# EAGLE design main (EAGLE 9.6.1)
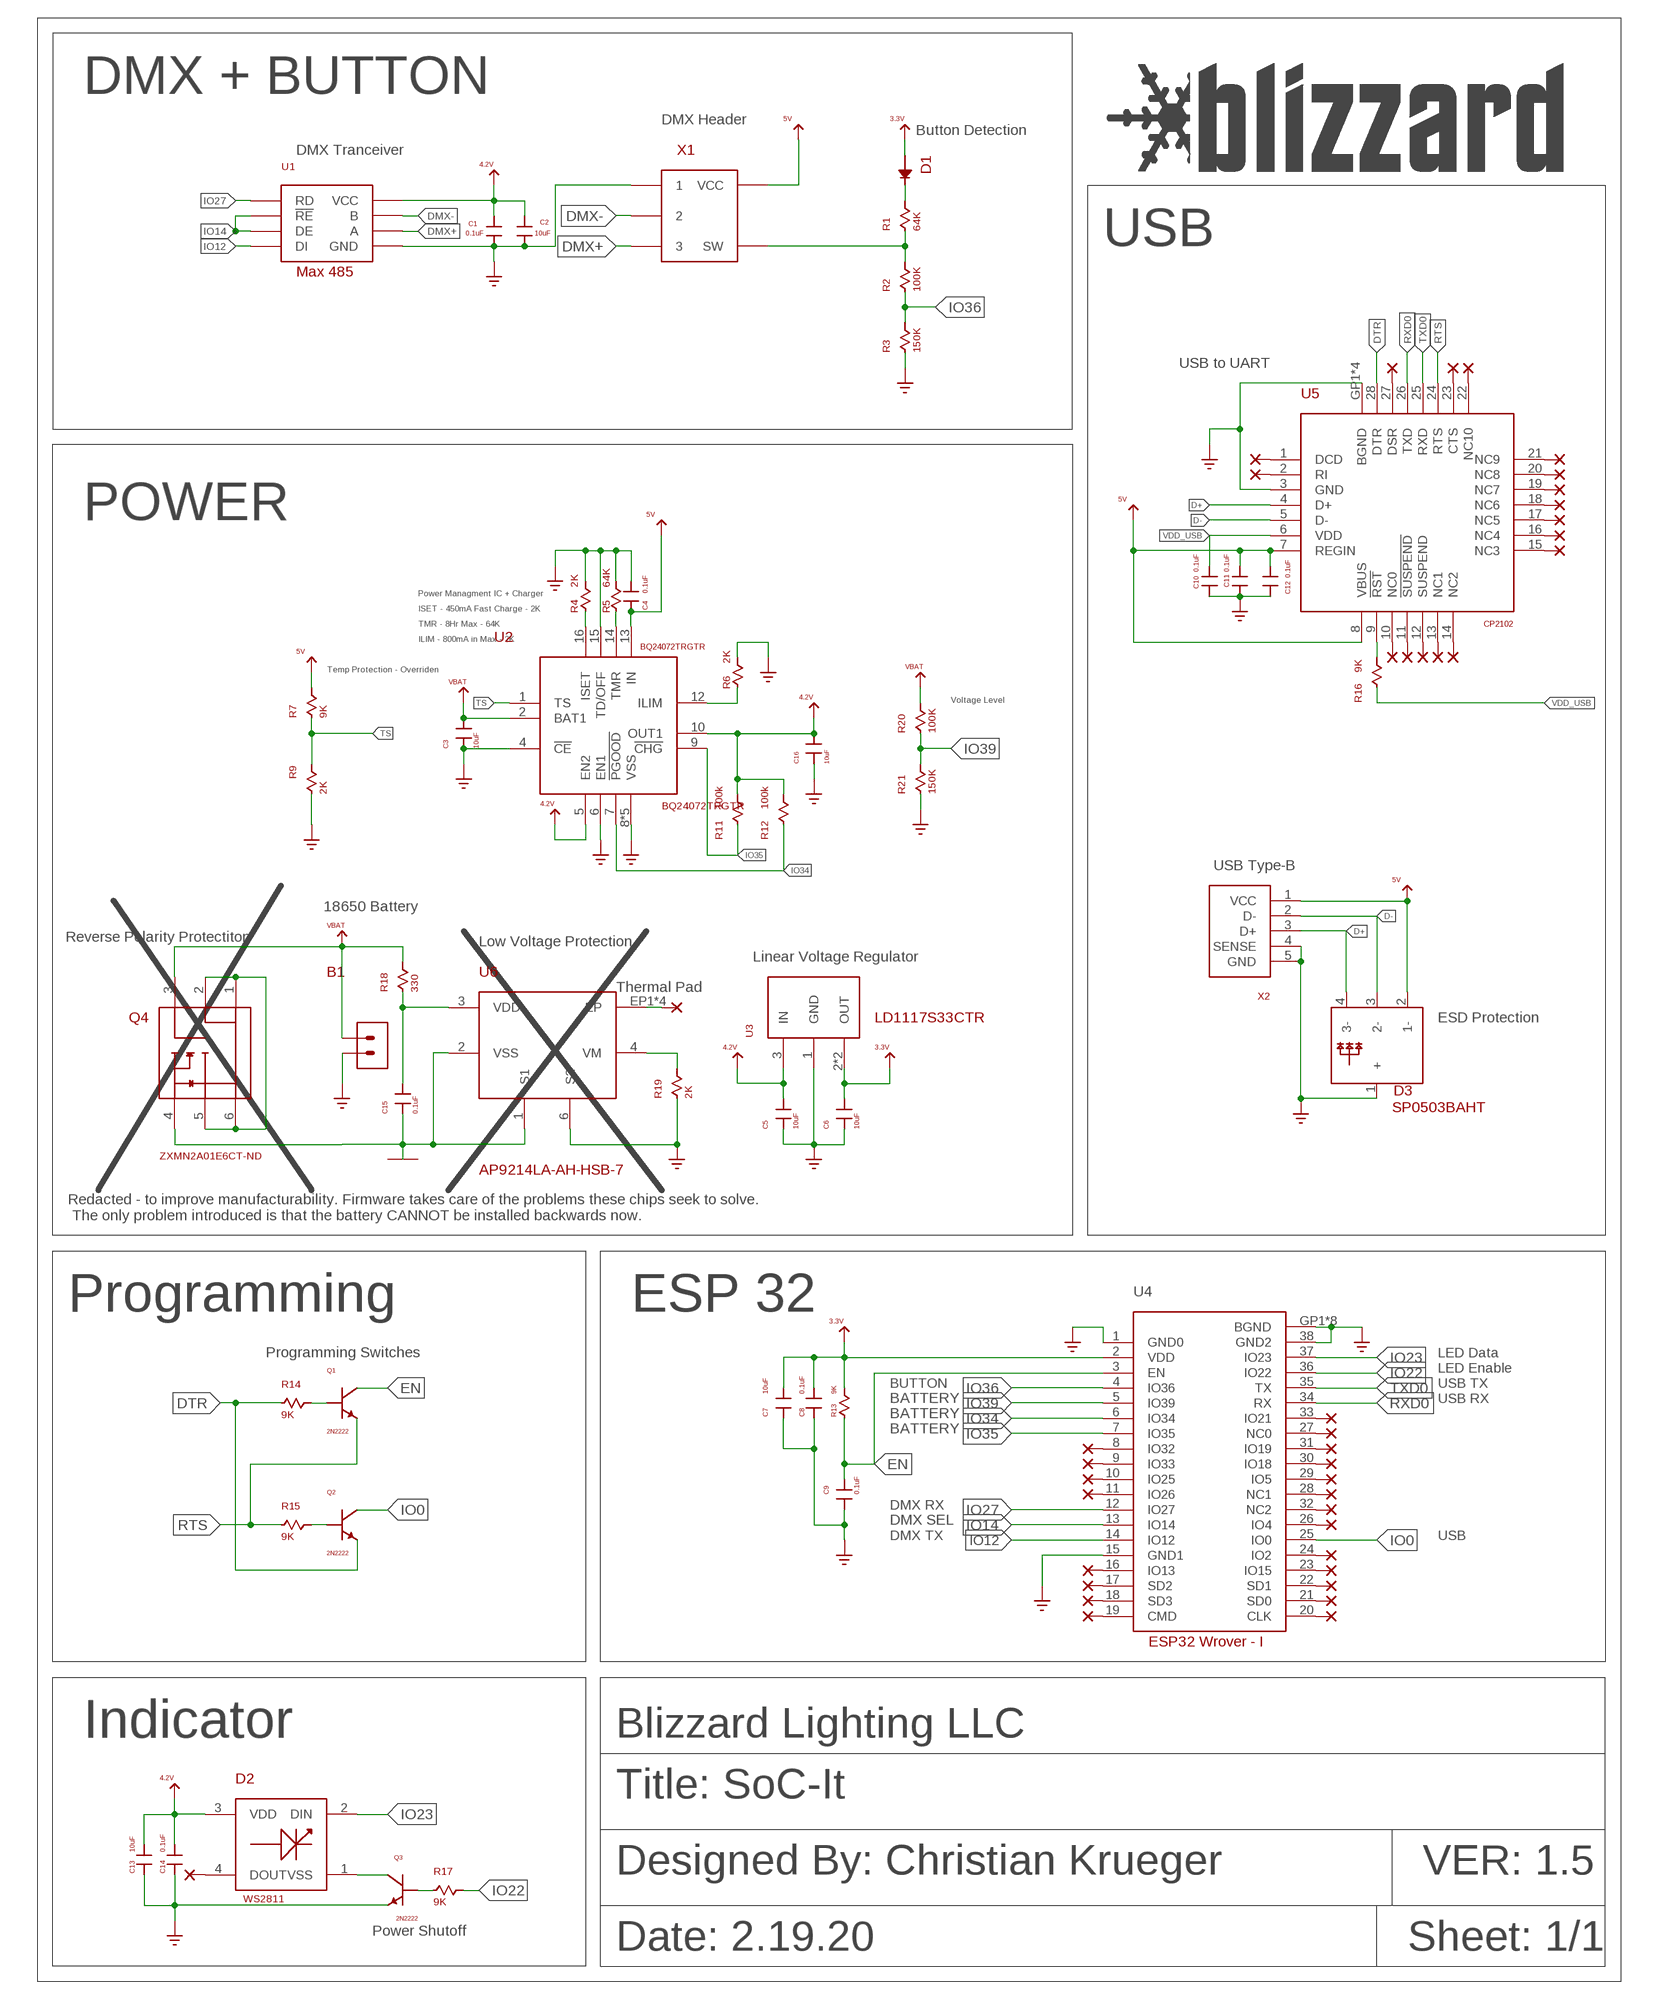
[diagram p0: schematic, sheet 1]

## Parts
B1  18650_BATTERY_DEV  [18650_BATTERY_PKG]
C1  0.1uF  0603_CAP_DEV3D  [CAPC1508X55]
C2  10uF  0603_CAP_DEV3D  [CAPC1508X55]
C3  10uF  0603_CAP_DEV3D  [CAPC1508X55]
C4  0.1uF  0603_CAP_DEV3D  [CAPC1508X55]
C5  10uF  0603_CAP_DEV3D  [CAPC1508X55]
C6  10uF  0603_CAP_DEV3D  [CAPC1508X55]
C7  10uF  0603_CAP_DEV3D  [CAPC1508X55]
C8  0.1uF  0603_CAP_DEV3D  [CAPC1508X55]
C9  0.1uF  0603_CAP_DEV3D  [CAPC1508X55]
C10  0.1uF  0603_CAP_DEV3D  [CAPC1508X55]
C11  0.1uF  0603_CAP_DEV3D  [CAPC1508X55]
C12  0.1uF  0603_CAP_DEV3D  [CAPC1508X55]
C13  10uF  0603_CAP_DEV3D  [CAPC1508X55]
C14  0.1uF  0603_CAP_DEV3D  [CAPC1508X55]
C15  0.1uF  0603_CAP_DEV3D  [CAPC1508X55]
C16  10uF  0603_CAP_DEV3D  [CAPC1508X55]
D1  0603_DIODE_DEV  [0603_DIODE]
D2  5050_DEV  [5050_PKG]
D3  USB_ESD_DEVSOT143  [SOT192P237X122-4]
GND1  GND  (no package)
GND2  GND  (no package)
GND3  GND  (no package)
GND4  GND  (no package)
GND5  GND  (no package)
GND6  GND  (no package)
GND7  GND  (no package)
GND8  GND  (no package)
GND9  GND  (no package)
GND10  GND  (no package)
GND11  GND  (no package)
GND12  GND  (no package)
GND13  GND  (no package)
GND14  GND  (no package)
GND15  GND  (no package)
GND16  GND  (no package)
GND17  GND  (no package)
GND18  GND  (no package)
GND19  GND  (no package)
GND20  GND  (no package)
GND21  GND  (no package)
NC1  NC  (no package)
NC2  NC  (no package)
NC3  NC  (no package)
NC4  NC  (no package)
NC5  NC  (no package)
NC6  NC  (no package)
NC7  NC  (no package)
NC8  NC  (no package)
NC9  NC  (no package)
NC10  NC  (no package)
NC11  NC  (no package)
NC12  NC  (no package)
NC13  NC  (no package)
NC14  NC  (no package)
NC15  NC  (no package)
NC16  NC  (no package)
NC17  NC  (no package)
NC18  NC  (no package)
NC19  NC  (no package)
NC20  NC  (no package)
NC21  NC  (no package)
NC22  NC  (no package)
NC23  NC  (no package)
NC24  NC  (no package)
NC25  NC  (no package)
NC26  NC  (no package)
NC27  NC  (no package)
NC28  NC  (no package)
NC29  NC  (no package)
NC30  NC  (no package)
NC31  NC  (no package)
NC32  NC  (no package)
NC33  NC  (no package)
NC34  NC  (no package)
NC35  NC  (no package)
NC36  NC  (no package)
NC37  NC  (no package)
NC38  NC  (no package)
NC39  NC  (no package)
NC40  NC  (no package)
Q1  2N2222  SOT23_TRANS3D  [SOT95P242X120-3]
Q2  2N2222  SOT23_TRANS3D  [SOT95P242X120-3]
Q3  2N2222  SOT23_TRANS3D  [SOT95P242X120-3]
Q4  N_MOSFET_DEVSOT23-6L_PKG  [SOT95P280X125-6]
R1  64K  0603_RES_DEV3D  [RESC1608X55]
R2  100K  0603_RES_DEV3D  [RESC1608X55]
R3  150K  0603_RES_DEV3D  [RESC1608X55]
R4  2K  0603_RES_DEV3D  [RESC1608X55]
R5  64K  0603_RES_DEV3D  [RESC1608X55]
R6  2K  0603_RES_DEV3D  [RESC1608X55]
R7  9K  0603_RES_DEV3D  [RESC1608X55]
R9  2K  0603_RES_DEV3D  [RESC1608X55]
R11  100k  0603_RES_DEV3D  [RESC1608X55]
R12  100k  0603_RES_DEV3D  [RESC1608X55]
R13  9K  0603_RES_DEV3D  [RESC1608X55]
R14  9K  0603_RES_DEV3D  [RESC1608X55]
R15  9K  0603_RES_DEV3D  [RESC1608X55]
R16  9K  0603_RES_DEV3D  [RESC1608X55]
R17  9K  0603_RES_DEV3D  [RESC1608X55]
R18  330  0603_RES_DEV3D  [RESC1608X55]
R19  2K  0603_RES_DEV3D  [RESC1608X55]
R20  100K  0603_RES_DEV3D  [RESC1608X55]
R21  150K  0603_RES_DEV3D  [RESC1608X55]
U1  MAX_485_DEV3D  [SOIC127P600X175-8]
U2  BQ24072TRGTR_DEVBQ24072TRGTR  [QFN50P300X300X100-17T168]
U3  LD1117S33CTR_DEVLD1117S33CTR  [SOT230P700X180-4]
U4  ESP_32_WROVER_I_PKG  [ESP32_WROVER_I_PKG]
U5  USB_TO_UART_DEV  [QFN50P500X500X100-28]
U6  AP9214L_DEV  [U-DFN2535-6_PKG]
VCC1  5V  VCC  (no package)
VCC2  3.3V  VCC  (no package)
VCC3  4.2V  VCC  (no package)
VCC4  5V  VCC  (no package)
VCC5  5V  VCC  (no package)
VCC6  VBAT  VCC  (no package)
VCC7  4.2V  VCC  (no package)
VCC8  4.2V  VCC  (no package)
VCC9  4.2V  VCC  (no package)
VCC10  3.3V  VCC  (no package)
VCC11  3.3V  VCC  (no package)
VCC12  5V  VCC  (no package)
VCC13  4.2V  VCC  (no package)
VCC14  5V  VCC  (no package)
VCC15  VBAT  VCC  (no package)
VCC16  VBAT  VCC  (no package)
X1  XLR_FEMALE_PLUG_DEV  [XLR_FEMALE_PLUG_PKG]
X2  USB_ALI_DEV  [CHEAP_USB]

## Nets
3.3V: C6.2 C7.2 C8.2 D1.A+ R13.2 U3.2(OUT) U3.4(OUT) U4.2(VDD) VCC2.P$1 VCC10.P$1 VCC11.P$1
4.2V: C1.1 C2.1 C5.2 C13.2 C14.2 C16.2 D2.3(VDD) R11.2 R12.2 U1.8(VCC) U2.5(EN2) U2.10(OUT1) U3.3(IN) VCC3.P$1 VCC7.P$1 VCC8.P$1 VCC9.P$1 VCC13.P$1
5V: C4.1 C11.2 C12.2 D3.2(1-) R7.2 U2.13(IN) U5.7(REGIN) U5.8(VBUS) VCC1.P$1 VCC4.P$1 VCC5.P$1 VCC12.P$1 VCC14.P$1 X1.VCC X2.1(VCC)
BATTERY_GROUND: Q4.1(D1) Q4.2(D2) Q4.5(D3) Q4.6(D4)
D+: D3.4(3-) U5.4(D+) X2.3(D+)
D-: D3.3(2-) U5.5(D-) X2.2(D-)
DMX+: U1.6(A) X1.3
DMX-: U1.7(B) X1.2
DTR: Q2.2(E) R14.1 U5.28(DTR)
EN: C9.2 Q1.3(C) R13.1 U4.3(EN)
GND: B1.- C1.2 C2.2 C3.1 C4.2 C5.1 C6.1 C7.1 C8.1 C9.1 C10.1 C11.1 C12.1 C13.1 C14.1 C16.1 D3.1(+) GND1.P$1 GND2.P$1 GND3.P$1 GND4.P$1 GND5.P$1 GND6.P$1 GND7.P$1 GND8.P$1 GND9.P$1 GND10.P$1 GND11.P$1 GND12.P$1 GND13.P$1 GND14.P$1 GND15.P$1 GND16.P$1 GND17.P$1 GND18.P$1 GND19.P$1 GND20.P$1 GND21.P$1 Q3.2(E) R3.1 R4.2 R5.2 R6.2 R9.1 R19.1 R21.1 U1.5(GND) U2.4(!CE) U2.6(EN1) U2.8(VSS) U2.15(TD/OFF) U2.GP1(VSS) U2.GP2(VSS) U2.GP3(VSS) U2.GP4(VSS) U3.1(GND) U4.1(GND0) U4.15(GND1) U4.38(GND2) U4.GP1(BGND) U4.GP2(BGND) U4.GP3(BGND) U4.GP4(BGND) U4.GP5(BGND) U4.GP6(BGND) U4.GP8(BGND) U4.GP9(BGND) U5.3(GND) U5.GP1(BGND) U5.GP2(BGND) U5.GP3(BGND) U5.GP4(BGND) U6.6(S2) X1.1 X2.4(SENSE) X2.5(GND)
IO0: Q2.3(C) U4.25(IO0)
IO12: U1.4(DI) U4.14(IO12)
IO14: U1.2(!RE) U1.3(DE) U4.13(IO14)
IO22: R17.2 U4.36(IO22)
IO23: D2.2(DIN) U4.37(IO23)
IO27: U1.1(RD) U4.12(IO27)
IO34: R12.1 U2.7(!PGOOD) U4.6(IO34)
IO35: R11.1 U2.9(!CHG) U4.7(IO35)
IO36: R2.1 R3.2 U4.4(IO36)
IO39: R20.1 R21.2 U4.5(IO39)
N$1: NC7.P$1 U4.17(SD2)
N$2: NC17.P$1 U5.11(!SUSPEND)
N$3: NC9.P$1 U4.18(SD3)
N$4: D2.1(VSS) Q3.3(C)
N$5: Q1.1(B) R14.2
N$6: Q2.1(B) R15.2
N$7: NC15.P$1 U5.1(DCD)
N$8: Q3.1(B) R17.1
N$9: R16.2 U5.9(!RST)
N$10: NC16.P$1 U5.2(RI)
N$11: NC21.P$1 U4.8(IO32)
N$12: NC13.P$1 U5.27(DSR)
N$13: NC14.P$1 U5.23(CTS)
N$14: NC18.P$1 U5.12(SUSPEND)
N$15: NC22.P$1 U4.9(IO33)
N$16: NC23.P$1 U4.10(IO25)
N$17: NC24.P$1 U4.11(IO26)
N$18: NC25.P$1 U4.16(IO13)
N$19: D1.C- R1.2
N$20: R1.1 R2.2 X1.SW
N$21: NC11.P$1 U4.19(CMD)
N$22: NC12.P$1 U4.20(CLK)
N$23: NC10.P$1 U4.21(SD0)
N$24: NC8.P$1 U4.22(SD1)
N$25: NC6.P$1 U4.23(IO15)
N$26: NC5.P$1 U4.24(IO2)
N$27: NC4.P$1 U4.32(NC2)
N$28: NC3.P$1 U4.28(NC1)
N$29: NC2.P$1 U4.29(IO5)
N$30: NC1.P$1 U4.27(NC0)
N$31: D2.4(DOUT) NC19.P$1
N$32: R19.2 U6.4(VM)
N$33: C15.2 R18.1 U6.3(VDD)
N$34: R6.1 U2.12(ILIM)
N$35: R5.1 U2.14(TMR)
N$36: NC26.P$1 U4.26(IO4)
N$37: R4.1 U2.16(ISET)
N$38: NC27.P$1 U4.30(IO18)
N$39: NC28.P$1 U4.31(IO19)
N$40: NC29.P$1 U4.33(IO21)
N$41: NC30.P$1 U5.10(NC0)
N$42: NC31.P$1 U5.14(NC2)
N$43: NC32.P$1 U5.13(NC1)
N$44: NC33.P$1 U5.15(NC3)
N$45: NC34.P$1 U5.16(NC4)
N$46: NC35.P$1 U5.17(NC5)
N$47: NC36.P$1 U5.18(NC6)
N$48: NC37.P$1 U5.19(NC7)
N$49: NC38.P$1 U5.20(NC8)
N$50: NC39.P$1 U5.21(NC9)
N$51: NC40.P$1 U5.22(NC10)
PROTECTION_GROUND: C15.1 Q4.4(S) U6.1(S1) U6.2(VSS)
PROTECTION_THERMAL_PAD: NC20.P$1 U6.EP1(EP) U6.EP2(EP) U6.EP3(EP) U6.EP4(EP)
RTS: Q1.2(E) R15.1 U5.24(RTS)
RXD0: U4.34(RX) U5.26(TXD)
TS: R7.1 R9.2 U2.1(TS)
TXD0: U4.35(TX) U5.25(RXD)
VBAT: B1.+ C3.2 Q4.3(G) R18.2 R20.2 U2.2(BAT1) VCC6.P$1 VCC15.P$1 VCC16.P$1
VDD_USB: C10.2 R16.1 U5.6(VDD)

## Notes on the sheet
- DMX + BUTTON
- DMX Header | Button Detection
- DMX Tranceiver
- USB
- Max 485
- USB to UART
- POWER
- Power Managment IC + Charger
- ISET - 450mA Fast Charge - 2K
- TMR - 8Hr Max - 64K | CP2102
- ILIM - 800mA in Max - 2K
- BQ24072TRGTR
- Temp Protection - Overriden
- Voltage Level
- USB Type-B
- 18650 Battery
- Reverse Polarity Protectiton
- Low Voltage Protection
- Linear Voltage Regulator
- Thermal Pad
- Q4 | LD1117S33CTR | ESD Protection
- AP9214LA-AH-HSB-7
- Redacted - to improve manufacturability. Firmware takes care of the problems these chips seek to solve.
   The only problem introduced is that the battery CANNOT be installed backwards now.
- Programming | ESP 32
- Programming Switches | LED Data
- LED Enable
- BUTTON | USB TX
- BATTERY | USB RX
- BATTERY
- BATTERY
- DMX RX
- DMX SEL
- DMX TX | USB
- ESP32 Wrover - I
- Indicator | Blizzard Lighting LLC
- Title: SoC-It
- Designed By: Christian Krueger | VER: 1.5
- WS2811
- Power Shutoff
- Date: 2.19.20 | Sheet: 1/1

## Library data of the parts
B1 = Blizzard_Library:18650_BATTERY_DEV: 36-1043-ND; PN: 36-1043-ND
C1-C16 = Blizzard_Library:0603_CAP_DEV: 0603 Capacitor
D1 = Blizzard_Library:0603_DIODE_DEV: 0603 Diode
D2 = Blizzard_Library:5050_DEV: 5050 RGB LED; PN: 1528-1104-ND
D3 = Blizzard_Library:USB_ESD_DEV: SP0503BAHT USB ESD Protection; PN: SP0503BAHT
GND1-GND21 = Blizzard_Library:GND: GROUND
NC1-NC40 = Blizzard_Library:NC: NC
Q1-Q3 = Blizzard_Library:SOT23_TRANS: 2N222 PNP Transitor; PN: MMBT2222A-FDICT-ND
Q4 = Blizzard_Library:N_MOSFET_DEV: N Mosfet SOT23-6L; PN: ZXMN2A01E6CT-ND
R1-R7 R9 R11-R21 = Blizzard_Library:0603_RES_DEV: 0603 Resister
U1 = Blizzard_Library:MAX_485_DEV: MAX 485 PN: MAX485CSA+-ND; PN: MAX485EESA+TCT-ND
U2 = Blizzard_Library:BQ24072TRGTR_DEV: IC LI-ION CHARGE MGMT 16QFN 296-27328-1-ND; PN: BQ24072TRGTR
U3 = Blizzard_Library:LD1117S33CTR_DEV: LD1117S33CTR
U4 = Blizzard_Library:ESP_32_WROVER_I_PKG: ESP32-WROVER-I; PN: GC-ESP-WROVER-32
U5 = Blizzard_Library:USB_TO_UART_DEV: SINGLE-CHIP USB-TO-UART BRIDGE PN: 336-1160-5-ND; PN: CP2102
U6 = Blizzard_Library:AP9214L_DEV: SINGLE CHIP SOLUTION FOR 1-CELL Li+ BATTERY PACK Option 1; PN: AP9214L; VERSION: A
VCC1-VCC16 = Blizzard_Library:VCC: VCC
X1 = Blizzard_Library:XLR_FEMALE_PLUG_DEV: XLR Female Plug to PCB
X2 = Blizzard_Library:USB_ALI_DEV: ALI USB Micro B

## Board
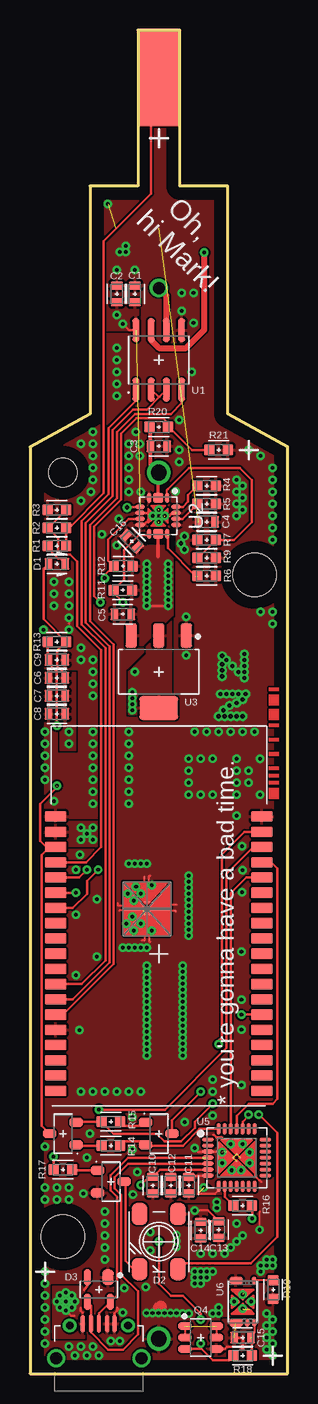
[diagram p1: board, top side]
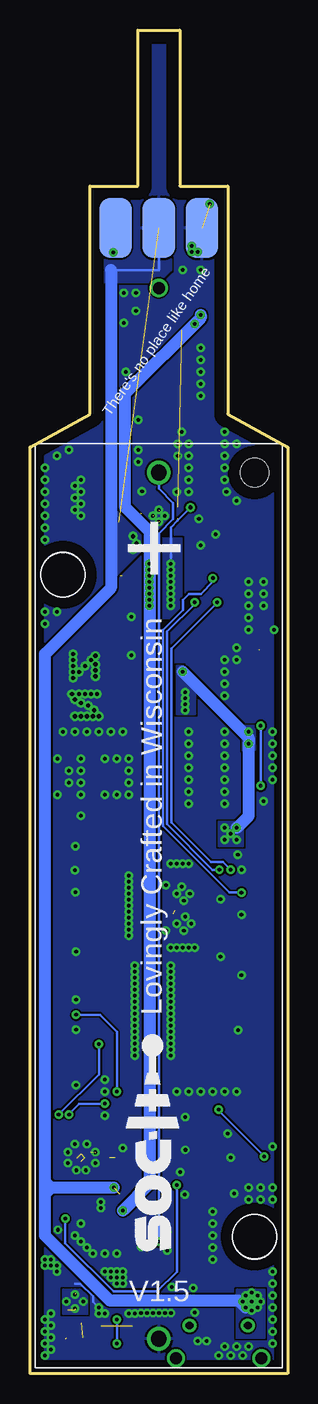
[diagram p2: board, bottom side, seen from below]

Size 21.5 x 112 mm. Coordinates in mm from the lower left corner, seen from the top.
Outline: 16.5,80 16.5,99 12.5,99 12.5,112 9,112 9,99 5,99 5,80 0,77.25 0,0 21.5,0 21.5,77.25 16.5,80
Copper layers (1*16): Top 0.035mm / dielectric 1.5mm / Bottom 0.035mm
Design rules "default *": minimum track width 6mil, minimum drill 0.3mm, track to track 6mil, track to pad 6mil, pad to pad 6mil, via to via 6mil, smd to smd 6mil, copper to edge 40mil, drill to drill 6mil, minimum pad ring 10mil, minimum via ring 8mil, stop-mask expansion 4mil, vias tented up to drill 0.30988125mm, thermal gap 8mil

### Footprints (pad centres in the part's own frame; a part is rotated, then mirrored left to right if it is on the bottom)
18650_BATTERY_PKG = drill 1.32: + 36.11,0; - -36.11,0 | hole 3.6: -27.6,-8; 27.6,8 | hole 2.39: 36.11,-8
CAPC1508X55 = smd 0.657 x 0.979: 1 -0.696,0; 2 0.696,0
0603_DIODE = smd 0.657 x 0.979: A+ -0.696,0; C- 0.696,0
5050_PKG = smd 1.8 x 1.3: 1 2.3,-1.6; 2 2.3,1.6; 3 -2.3,1.6; 4 -2.3,-1.6
SOT192P237X122-4 = smd 1.298 x 0.992: 1 -1.027,0.759 | smd 1.298 x 0.589: 2 -1.027,-0.96; 3 1.027,-0.96; 4 1.027,0.96
SOT95P242X120-3 = smd 1.092 x 0.772: 1 -1.113,0.95; 2 -1.113,-0.95; 3 1.113,0
SOT95P280X125-6 = smd 1.121 x 0.599: 1 -1.297,0.95; 2 -1.297,0; 3 -1.297,-0.95; 4 1.297,-0.95; 5 1.297,0; 6 1.297,0.95
RESC1608X55 = smd 0.87 x 0.929: 1 -0.78,0; 2 0.78,0
SOIC127P600X175-8 = smd 1.968 x 0.589: 1 -2.473,1.905; 2 -2.473,0.635; 3 -2.473,-0.635; 4 -2.473,-1.905; 5 2.473,-1.905; 6 2.473,-0.635; 7 2.473,0.635; 8 2.473,1.905
QFN50P300X300X100-17T168 = smd 0.8 x 0.34: 1 -1.5,0.75; 4 -1.5,-0.75; 9 1.5,-0.75; 12 1.5,0.75 | smd 0.8 x 0.8: 2 -1.5,0; 10 1.5,0 | smd 0.34 x 0.8: 5 -0.75,-1.5; 6 -0.25,-1.5; 7 0.25,-1.5; 8 0.75,-1.5; 13 0.75,1.5; 14 0.25,1.5; 15 -0.25,1.5; 16 -0.75,1.5 | smd 0.3 x 0.3: GP1 -0.5,0; GP2 0,0.5; GP3 0.5,0; GP4 0,-0.5
SOT230P700X180-4 = smd 1.965 x 0.934: 1 -3.023,2.3; 2 -3.023,0; 3 -3.023,-2.3 | smd 1.965 x 3.234: 4 3.023,0
ESP32_WROVER_I_PKG = smd 1.8 x 0.9: 1 -8.6,11.43; 2 -8.6,10.16; 3 -8.6,8.89; 4 -8.6,7.62; 5 -8.6,6.35; 6 -8.6,5.08; 7 -8.6,3.81; 8 -8.6,2.54; 9 -8.6,1.27; 10 -8.6,0; 11 -8.6,-1.27; 12 -8.6,-2.54; 13 -8.6,-3.81; 14 -8.6,-5.08; 15 -8.6,-6.35; 16 -8.6,-7.62; 17 -8.6,-8.89; 18 -8.6,-10.16; 19 -8.6,-11.43; 20 8.6,-11.43; 21 8.6,-10.16; 22 8.6,-8.89; 23 8.6,-7.62; 24 8.6,-6.35; 25 8.6,-5.08; 26 8.6,-3.81; 27 8.6,-2.54; 28 8.6,-1.27; 29 8.6,0; 30 8.6,1.27; 31 8.6,2.54; 32 8.6,3.81; 33 8.6,5.08; 34 8.6,6.35; 35 8.6,7.62; 36 8.6,8.89; 37 8.6,10.16; 38 8.6,11.43 | smd 0.1 x 0.1: GP1 -1.3,4; GP2 -1.2,4.3; GP3 -0.8,4.3; GP4 -0.7,4; GP5 -0.7,3.6; GP6 -0.8,3.3; GP8 -1.2,3.3; GP9 -1.3,3.6
QFN50P500X500X100-28 = smd 0.95 x 0.3: 1 -2.4,1.5; 2 -2.4,1; 15 2.4,-1.5; 16 2.4,-1; 17 2.4,-0.5; 18 2.4,0; 19 2.4,0.5; 20 2.4,1; 21 2.4,1.5 | smd 0.95 x 0.34: 3 -2.4,0.5; 4 -2.4,0; 5 -2.4,-0.5; 6 -2.4,-1; 7 -2.4,-1.5 | smd 0.34 x 0.95: 8 -1.5,-2.4; 9 -1,-2.4; 24 0.5,2.4; 25 0,2.4; 26 -0.5,2.4; 28 -1.5,2.4 | smd 0.3 x 0.95: 10 -0.5,-2.4; 11 0,-2.4; 12 0.5,-2.4; 13 1,-2.4; 14 1.5,-2.4; 22 1.5,2.4; 23 1,2.4; 27 -1,2.4 | smd 0.1 x 0.1: GP1 -0.3,0; GP2 0,0.3; GP3 0.3,0; GP4 0,-0.3
U-DFN2535-6_PKG = smd 0.69 x 1.1: 1 -1.77,0.55; 6 1.75,0.55 | smd 0.69 x 0.32: 2 -1.75,-0.38; 3 -1.75,-0.97; 4 1.75,-0.95 | smd 0.1 x 0.1: EP1 -0.7,0; EP2 0,0.7; EP3 0.7,0; EP4 0,-0.7
XLR_FEMALE_PLUG_PKG = smd 2.7 x 5: 1 3.61,0; 2 -3.61,0; VCC 0,0 | drill 1: 3 0,-5 | smd 3.5 x 8 bottom: SW 0,12.5
CHEAP_USB = smd 0.35 x 1.5: 1 -1.35,0.15; 4 0.7,0.15; 5 1.3,0.15 | smd 0.33 x 1.5: 2 -0.65,0.15; 3 0,0.15 | drill 1: P$6 -3.575,-2.73; P$7 3.575,-2.73 | drill 0.65: P$8 2.425,0; P$9 -2.425,0

### Placement (x,y rotation side)
B1  10.75,39 90 bottom
C1  8.75,90 90 top
C2  7.25,90 90 top
C3  10.75,77.3 180 top
C4  14.75,71 0 top
C5  7.75,63.3 0 top
C6  2.25,58 0 top
C7  2.25,56.5 0 top
C8  2.25,55 0 top
C9  2.25,59.5 180 top
C10  10.25,15.7 90 top
C11  13.25,15.7 90 top
C12  11.75,15.7 90 top
C13  15.75,12 90 top
C14  14.25,11.95 90 top
C15  17.75,3 0 top
C16  8.5,69.38 315 top
D1  2.25,67.5 0 top
D2  10.75,11 270 top
D3  5.75,7 270 top
Q1  2.75,20 180 top
Q2  10.75,20 0 top
Q3  6.75,16 0 top
Q4  14.25,3 0 top
R1  2.25,69 180 top
R2  2.25,70.5 0 top
R3  2.25,72 0 top
R4  14.75,74 0 top
R5  14.75,72.5 0 top
R6  14.75,66.5 0 top
R7  14.75,69.5 180 top
R9  14.75,68 180 top
R11  7.75,65.3 0 top
R12  7.78,67.31 0 top
R13  2.25,61 0 top
R14  6.75,19 180 top
R15  6.75,21 0 top
R16  17.75,14 180 top
R17  2.75,17 180 top
R18  17.75,1.5 180 top
R19  20.3,7 90 top
R20  10.75,78.9 180 top
R21  15.75,77 180 top
U1  10.75,84.5 90 top
U2  10.7,71.5 270 top
U3  10.75,58.5 270 top
U4  10.75,35 0 top
U5  17.25,18 0 top
U6  17.75,6 90 top
X1  10.75,95.5 0 bottom
X2  5.75,4 0 top

### Tracks (layer width: path | path; a pad name or v marks a point on that pad's centre or on a via)
3.3V  (via drill 0.3)  (1 unrouted)
  Top 0.2: D1.A+ 1.15,67.1 1.15,62.88 R13.2 2.37,60.34 | 2.95,58.33 C6.2 2.95,58.3 2.25,59 2.25,60.22 2.39,60.36
  Bottom 1: v4.25,45.5 3.25,46.5 v3.25,52.5 3.25,53 v8.75,58.5
  other vias: 3.25,53.5 4.25,44.5 5.25,44.5 5.25,45.5 8.55,55.3 8.55,55.8 8.55,56.3 8.55,56.8 4.75,45
  pour Top: 3.75,52 3.75,58.4 2.45,58.4 2.55,54 2.55,52
  pour Top: 0.75,44 5.75,44 5.75,46 0.75,46
  pour Bottom: 2.75,52 3.75,52 3.75,54 2.75,54
  pour Bottom: 3.75,44 3.75,46 5.75,46 5.75,44
  pour Top (rank 3): 11.75,55 11.75,63 9.75,63 9.75,60 8.25,58.5 8.25,55
  pour Bottom: 7.75,55 7.75,57 8.75,58 8.75,59 9.25,59 9.25,55
4.2V  (via drill 0.3, 0.35)  (1 unrouted)
  Top 0.2: v9.75,64 v11.55,64 | C14.2 14.3,12.7 C13.2 14.85,13.6 v13.75,13.6 | v8.1,72.2 8.15,72.25 U2.5 | U1.8 8.28,86.97 v7.75,87.5
  Top 0.305: U2.10 10.7,68.1
  Bottom 0.2: v9.75,67.5 9.75,70.54 9.19,71.1 9.19,71.11 v8.1,72.2
  Bottom 1: v7.25,88.25 7.25,88 13.59,81.66 13.59,72.27 11.5,70.18 11.5,15.85 v13.75,13.6
  other vias: 9.75,67 9.75,66.5 9.75,66 9.75,65.5 9.75,65 9.75,64.5 11.55,64.5 11.55,65 11.55,65.5 11.55,66 11.55,66.5 11.55,67 11.55,67.5
  pour Top: 11.75,12.5 11.75,14 14.75,14 14.75,12.5
  pour Top: 9,87 9,89.5 6.25,89.5 6.25,87
  pour Top (rank 2): 8.25,69 11.91,69 11.91,63.22 9.44,60.75 8.25,60.75
  pour Bottom: 8.85,63 10.75,63 10.75,69.6 8.85,69.6
5V  (via drill 0.3, 0.35)  (2 unrouted)
  Top 0.152: C11.2 13.38,16.4 13.48,16.5 | 15.42,14.98 15.17,14.98
  Top 0.2: U5.7 13.48,16.5 | U5.8 15.75,15.31 15.42,14.98 14.01,14.98 | 4.24,5.5 4.24,5.22 4.4,5.06 | 3.67,4.83 3.42,4.83 3.25,5 | D3.2 4.79,7.29 4.5,7
  Bottom 0.2: X1.VCC 10.75,92 14.75,92
  Bottom 1: v3.5,5.5 4.1,6.1 14.85,6.1 20.23,11.48 20.23,15 | 20.23,15 20.23,16 | 20.23,16 20.23,60 14.75,65.48 14.75,92 | v14.5,15.5 19.73,15.5 | 19.73,15.5 20.23,16 | 20.23,15 19.73,15.5
  other vias: 2.5,5.5 2.5,6.5 3.5,6.5 3,6 3,6.75 2.25,6 3.75,6 3,5.25 12.9,69.8 12.6,69.2 12.9,68.7
  pour Bottom: 9.75,98 9.75,92 10.75,91 15.75,91 15.75,98
  pour Bottom: 1.95,3 4.25,3 4.25,7 1.95,7
  pour Top (rank 3): 13.62,15 13.62,16 11.75,16 11.75,17 16.25,17 16.25,15
  pour Top: 14.25,67.5 14.25,71.75 12.25,71.75 12.25,68.25 13,67.5
  pour Top: 4.5,3 4.5,7.25 1.95,7.25 1.95,3
  pour Bottom: 9,99 7,101 7,113.5 14.5,113.5 14.5,101 12,98.5 12,97 9.5,97 9.5,98.5
  pour Bottom: 14.7,66.2 14.6,66.3 14.6,72.1 14.6,72.2 14.6,72.3
  pour Bottom: 12.2,68.6 14.7,66.1 14.7,72.2 14.7,72.3 12.2,69.8
BADBOI
  pour Top: 15.75,15.13 15.75,16.5 14.38,16.5
  pour Top: 15.65,16.4 15.65,19.6 18.85,19.6 18.85,16.4
  pour Top: 14.4,18.2 15.3,18.2 15.3,18.8 14.4,18.8
BATTERY_GROUND  (1 unrouted)
  Top 0.152: Q4.6 Q4.5 | Q4.1 Q4.2
D+  (1 unrouted)
  Top 0.2: X2.3 5.75,5.01 D3.4 7.26,6.52 7.26,14.74 6.71,15.29 6.71,16.54 8.18,18 14.4,18
D-
  Top 0.2: D3.3 5.1,5.66 X2.2 5.1,3.42 6.52,2 7.75,2 9.01,3.26 9.01,6.84 7.61,8.24 7.61,14.89 7.06,15.44 7.06,16.36 8.2,17.5 U5.5
DMX+
  Top 0.5: U1.6 11.38,89.86 X1.3
DMX-  (via drill 0.3)
  Top 0.5: U1.7 10.12,86.14 10.75,85.5 13.03,85.5 14.55,87.02 v14.55,93.45
  Bottom 0.2: X1.2 14.55,95.31 v14.55,93.45
DTR
  Top 0.2: 9.59,19 Q2.2 | 9.59,19 12.75,19 14.15,20.4 U5.28 | R14.1 7.89,19.36 9.22,19.36 9.59,19
EN  (via drill 0.3)  (1 unrouted)
  Top 0.2: R13.1 1.47,59.58 C9.2 | C9.2 1.55,59.17 | v2.24,49 2.24,48.85 0.87,47.47 0.87,44.38 1.36,43.89 U4.3 1.86,43.89 1.75,44 1,43.25 1,20.64 Q1.3 | C9.2 1.55,59.2 2.24,58.51 v2.24,54
  Bottom 0.2: v2.24,54 v2.25,53.99 v2.25,49
GND  (via drill 0.3, 0.35)  (10 unrouted)
  Top 0.152: U4.GP2 9.55,41.4 | U4.GP3 9.95,41.5 10.05,41.5 | U4.GP4 10.05,39.1 12.25,39.1 | U4.GP5 12.15,38.6 12.15,38.5 | U4.GP6 9.95,36 10.05,36 | U4.GP8 9.55,36.1 9.35,36.1 | U4.GP9 7.45,38.6 | U4.GP1 7.35,39 7.35,39.2 | U5.GP1 16.45,18.5 | v19.18,11.98 19.18,13.49 19.19,13.5
  Top 0.2: 3.25,62.54 v3.25,63 | 12.25,76.2 12.25,76 | X2.5 7.05,5.01 7.26,5.22 7.26,5.5 7.67,5.09 v7.75,5.09 | U2.6 10,71.75 v10.25,71.5 | 9.4,70.75 U2.8 9.3,70.85 9.62,70.85 9.85,71.08 9.85,71.15 U2.GP4 | 12.22,71.67 11.95,71.67 | v13.74,18.79 14.03,18.5 U5.3 15.98,18.5 v16.04,18.44 | v18.34,17.54 18.82,17.06 18.82,16.43 19.16,16.1 19.2,16.1 19.3,16 | v16.74,19.14 16.56,19.14 16.03,19.67 15.57,19.67 15.35,19.9 15.3,19.9 | U2.15 12.1,71.65 11.78,71.65 11.63,71.5 v11.25,71.5
  Top 1.016: 10.75,5.45 10.9,5.6
  Bottom 0.2: v15.75,5.5 16.25,6 16.25,6.44 17.31,7.5 17.75,7.5
  other vias: 13.05,63.1 7.25,69.05 9.25,73.5 12.65,90.1 6.75,2.7 4.45,15 2,47.73 4.13,28.61 17.65,31.15 17.71,40.12 17.25,46.5 3.85,38.25 5.6,39.55 5.6,34.75 3.85,33.2 6.25,9.5 8.6,14.9 9.66,7.21 9.73,5.03 15.25,21.5 1.25,49.5 1.25,50.5 17.65,24.05 17.65,28.65 12.9,20.95 15.25,23.5 6.25,10.5 6.25,11.5 6.25,12.5 6.25,13.5 1.25,14.5 2.25,14.5 3.25,14.5 3.25,15.5 2.25,15.5 1.25,15.5 4.15,43.25 17.7,43.98 8.95,16.8 3.82,42 17.75,41.95 1.25,8.5 1.25,7.5 1.25,6.5 1.25,5.5 1.25,4.5 1.25,3.5 1.25,2.5 3.25,2.25 4.25,2.25 3.75,1.5 4.75,1.5 10.73,5.03 11.73,5.03 15.6,14.3 4.75,18 1.25,18.9 4.25,23.5 5.25,23.5 6.25,23.5 7.25,23.5 8.25,23.5 9.25,23.5 13.65,90.1 12.65,88.6 8.75,92 13.5,83.5 7.25,92 7.25,85.5 18.25,77 7.25,84.5 7.25,83.5 7.25,82.5 7.25,81.5 5.25,78.5 5.25,76.5 5.25,77.5 4.25,77.5 5.25,75.5 5.25,74.5 2,66 3.25,66 3.25,65 2,65 2,64 3.25,64 1.25,51.5 1.25,52.5 1.25,53.5 5.25,56.5 5.25,57.5 5.25,58.5 5.25,59.5 4.25,59.5 5.25,52.5 5.25,53.5 5.25,51.5 5.25,50.5 5.25,49.5 5.25,48.5 5.25,47.5 17.25,71.5 17.25,72.5 17.25,73.5 17.25,74.5 20.25,70.5 20.25,71.5 20.25,72.5 20.25,73.5 20.25,74.5 20.25,75.5 20.25,69.5 19.25,76.5 9.15,77.5 9.15,76.5 8.85,78.5 5.1,73.5 4.25,72.75 7.4,71.25 8.25,73.5 8.25,74.5 8.25,75.5 8.25,76.5 8.25,77.5 8.25,47.5 8.25,48.5 8.25,49.5 8.25,50.5 8.25,52.5 8.25,51.5 8.25,53.5 15.25,51.25 14.25,51.25 13.25,51.25 13.25,50.25 13.25,49.25 13.25,48.25 14.25,48.25 15.25,48.25 19.2,51.25 18.25,50.25 18.25,49.25 19.2,48.25 17.25,49.25 17.25,48.25 17.25,50.25 17.25,51.25 13.25,41.5 13.25,40.5 13.25,39.5 13.25,38.5 13.25,37.5 13.25,36.5 9.25,35.5 8.25,35.5 8.25,42.5 9.25,42.5 16.65,55.69 17.4,56.65 16.9,56.65 17.75,54.79 15.9,56.65 16.4,56.65 17.25,54.79 16.75,54.79 16.25,54.79 16.15,55.29 20.25,62.5 20.25,63.5 19.25,63.5 20.25,1.5 19.75,2 20.25,2.5 19.75,3 20.25,3.5 19.75,4 20.25,4.5 19.75,5 20.25,9.5 19.75,9 15.25,5 12.75,5 12.23,11.03 16.25,10 17.75,11.5 16.75,10.5 17.25,11 13.75,8.5 14.75,8.5 10.03,10.26 10.05,11.81 15.25,10 14.25,10 17.25,12.5 17.75,72 17.75,73 17.75,74 7.5,2.7 12.45,77 12.45,76 12.45,79.5 12.15,73.53 17.65,35.15 5.99,69.94 1.14,61.99 13.04,59.88 17.25,55.89 18,56.65 15.75,54.79 17.75,56.19 13.65,87.6 8,93.5 7.5,93.5 8,94 6.5,97.5 16.9,58.97 16.04,59.12 16.04,58.62 17.9,59.97 17.9,59.47 16.04,58.12 17.9,58.97 17.9,58.47 17.9,57.97 17.4,58.47 16.4,59.47 16.04,59.83 7.87,7.12 13.75,8 14.25,8 14.25,8.5 14.75,8 14.25,7.5 13.75,7.5 19.25,8.5 19.25,9 19.75,9.5 20.25,9 12.23,10.53 12.23,11.53 15.25,8.5 10.23,5.03 11.23,5.03 12.23,5.03 13.25,5 15.75,5 15.6,13.8 9.75,26.5 9.75,27 9.75,27.5 9.75,28 9.75,28.5 9.75,29 9.75,29.5 9.75,30 9.75,30.5 9.75,31 9.75,31.5 9.75,32 9.75,32.5 9.75,33 9.75,33.5 9.75,34 12.75,34 12.75,33.5 12.75,33 12.75,32.5 12.75,32 12.75,31.5 12.75,31 12.75,30.5 12.75,30 12.75,29.5 12.75,29 12.75,28 12.75,28.5 12.75,27.5 12.75,27 12.75,26.5 8.75,35.5 7.75,35.5 9.75,35.5 9.75,42.5 8.75,42.5 13.25,37 13.25,38 13.25,39 13.25,40 13.25,41 5.01,20 8.54,21.39 8.53,18.64 15.25,24.5 4.25,60.5 5.25,2.25 5.75,1.5 3.25,62 13.75,53.5 14.75,53.5 15.75,53.5 16.75,53.5 17.75,53.5 18.75,53.5 8.65,36.9 9.25,37.5 8.05,37.5 8.55,38.1 8.15,40 8.65,39.4 8.85,40.6 9.25,40 10.15,40.7 10.15,36.9 16.04,17.54 17.74,19.14 18.34,18.44 17.64,16.94 16.84,16.94 10.75,72 10.75,71
  pour Top (rank 5): -1.25,-1 -1.25,112.5 22.75,112.5 22.75,-1
  pour Bottom (rank 5): -2.25,-2 -2.25,113.5 24.25,113.5 24.25,-2
IO0  (via drill 0.3)
  Top 0.2: U4.25 17.67,29.92 v17.65,29.9 | Q2.3 11.86,21.11 v14.25,23.5
  Bottom 0.2: v14.25,23.5 14.25,28.5 15.65,29.9 v17.65,29.9
IO12
  Top 0.2: U4.14 2.79,29.92 7,34.13 7,60.75 5,62.75 5,70.75 7.25,73 7.25,78.5 8.75,80 11.75,80 12.65,80.91 U1.4
IO14
  Top 0.2: U4.13 3.56,31.19 6.64,34.28 6.64,60.61 4.65,62.6 4.65,70.9 6.9,73.15 6.9,78.65 8.6,80.35 9.75,80.35 10.82,81.43 | 10.82,81.43 11.38,81.99 U1.3 | U1.2 10.71,81.43 10.82,81.43
IO22  (via drill 0.3)
  Top 0.2: R17.2 1.97,18.08 v1.95,18.1 | v5.75,22 11.25,22 16.4,27.15 16.4,41.65 18.64,43.89 U4.36
  Bottom 0.2: v5.75,22 5.75,21.9 v1.95,18.1
IO23  (via drill 0.3)
  Top 0.2: D2.2 12.85,9.2 18.45,9.2 20.63,11.38 20.63,20.07 v19.1,21.6 | U4.37 17.91,45.16 16.03,43.28 16.03,28 15.74,27.71 v15.74,27.45
  Bottom 0.2: v15.74,27.45 15.74,24.96 v19.1,21.6
IO27
  Top 0.2: U1.1 8.85,81.09 6.54,78.79 6.54,73.29 4.29,71.04 4.29,62.46 6.29,60.46 6.29,34.42 4.33,32.46 U4.12
IO34  (via drill 0.3)  (1 unrouted)
  Top 0.2: U4.6 3.83,40.08 v3.85,40.1 | v6.23,66.31 6.23,66.54 R12.1 6.54,67.77 6.54,69.53 8.25,71.24 9.14,71.24
  Bottom 0.2: v3.85,40.1 4.85,40.1 10.4,45.65 10.4,62 8.75,63.64 8.75,64.5 8.25,65 7.25,65 6.23,66.02 v6.23,66.31
IO35  (via drill 0.3)  (1 unrouted)
  Top 0.2: v7.75,64.3 6.9,65.15 7,65.25 6.97,65.28 R11.1 7.84,66.17 7.84,68.63 9.11,69.9 9.85,69.9 U2.9 | v5.69,42 4.75,41.06 4.75,40 3.56,38.81 U4.7
  Bottom 0.2: v7.75,64.3 7.75,64.14 10.04,61.85 10.04,45.79 6.25,42 v5.69,42
IO36
  Top 0.2: R3.2 1.53,70.5 R2.1 2.34,69.63 2.34,68.43 2.49,68.28 3.34,68.28 3.94,67.68 3.94,62.31 5.94,60.31 5.94,43.89 4.67,42.62 U4.4
IO39  (via drill 0.3)
  Top 0.2: v5.87,64.28 5.35,64.79 5.35,70.6 7.6,72.85 7.6,78.35 8.9,79.65 11.1,79.65 11.53,79.22 R20.1 11.6,78.9 13.5,77 R21.2 | v4.75,42 4.1,41.35 U4.5
  Bottom 0.2: v5.87,64.28 9.69,60.45 9.69,45.94 6.4,42.65 5.4,42.65 v4.75,42
N$4
  Top 0.2: Q3.3 7.96,15.9 7.96,9.39 8.65,8.7 D2.1
N$5
  Top 0.2: Q1.1 3.91,19 R14.2
N$6
  Top 0.2: 7.58,20.95 R15.2 7.89,20.64 9.32,20.64 Q2.1
N$8
  Top 0.2: R17.1 3.58,16.95 Q3.1
N$9
  Top 0.2: U5.9 16.25,14.72 R16.2
N$19
  Top 0.2: D1.C- 2.52,67.93 2.34,67.93 1.47,68.81 R1.2
N$20
  Top 0.152: X1.SW 10.12,107.37 10.12,104.93
  Top 0.2: R1.1 R2.2 3.25,70.5 6.16,73.41 6.16,94.41 10.12,98.37 10.12,104.93
N$32
  Top 0.152: R19.2 18.73,7.78 U6.4
N$33  (1 unrouted)
  Top 0.152: U6.3 18.72,3.38 18.45,3.11
  Top 0.2: R18.1 18.53,2.92 | 18.45,3.11 C15.2
N$34  (2 unrouted)
  Top 0.2: 13.8,66.5 11.5,68.8 11.5,69.85
N$35
  Top 0.2: R5.1 12.72,71.25 U2.14
N$37
  Top 0.2: 13.97,73.87 R4.1 13.2,73.23 13.2,72.7 12.75,72.25 U2.16
PROTECTION_GROUND  (1 unrouted)
  Top 0.2: Q4.4 16.26,2.05 16.43,2.22 17.53,2.22 17.75,2 17.75,3 C15.1
  pour Top (rank 3): 14.75,1.5 17.25,1.5 18.75,3 18.75,4.5 15.75,4.5 14.75,3.5
PROTECTION_THERMAL_PAD  (via drill 0.3)  (3 unrouted)
  Top 0.152: 18.35,5.3 18.65,5
  other vias: 17.05,6 18.45,6 17.75,5.4 17.75,6.6
  pour Bottom: 16.75,5 18.75,5 18.75,7 16.75,7
  pour Bottom: 16.75,5 18.75,5 18.75,7 16.75,7
REDRUM
  pour Top: 7.75,36.5 11.75,36.5 11.75,41 7.75,41
  pour Top: 9.85,70.6 11.75,70.6 11.75,72.4 9.85,72.4
RTS  (via drill 0.3)
  Top 0.2: Q1.2 3.91,21 R15.1 6.97,20 10.57,20 11.21,19.36 12.61,19.36 13.75,20.5 13.75,21 v15.25,22.5 | U5.24 17.75,21 18.23,21.48 v18.23,21.6
  Bottom 0.2: v15.25,22.5 17.38,22.5 18.23,21.64 v18.23,21.6
RXD0
  Top 0.2: U5.26 16.75,40.06 18.04,41.35 U4.34
TS
  Top 0.152: U2.1 11.45,73.7 11.5,73.75
  Top 0.2: 11.5,73.75 13.25,75.5 17.5,75.5 18.5,74.5 18.5,70.97 17.03,69.5 R7.1 14.03,68 R9.2
TXD0
  Top 0.2: U5.25 17.25,21.5 18.25,22.5 20.25,22.5 20.63,22.88 20.63,42.12 20.13,42.62 U4.35
VBAT  (via drill 0.3)
  Top 0.2: 10.05,77.2 C3.2 9.97,77.38 | R18.2 16.59,1.12 15.26,1.12 14.31,2.06 14.3,2.05 | Q4.3 14.3,2.05 | v14.25,2.5 14.25,2.1 14.3,2.05 | v10.75,11 10.75,7.5 11.75,6.5 12.75,6.5 14.25,5 v14.25,4.5 | B1.+ 10.67,75.03
  Top 0.305: U2.2 10.7,75 10.67,75.03
  Top 0.34: B1.+ 10.05,75.81 10.05,77.2 | C3.2 10.05,78.82 R20.2
  Bottom 0.2: v10.75,11 10.75,70.04 9.54,71.25 9.54,72.55 10.75,73.76 B1.+ | v14.25,2.5 v14.25,4.5
VDD_USB  (via drill 0.3)
  Top 0.2: R16.1 18.55,13.98 v18.55,12.9 | v9.25,15.7 9.95,16.4 C10.2 10.85,17 U5.6
  Bottom 0.2: v18.55,12.9 18.55,10.86 14.54,6.85 10.9,6.85 9.25,8.5 v9.25,15.7
(copper drawn outside any net)
  shapes: Top area x13

### Text on the board
tPlace: hi Mark! | Oh, | * you're gonna have a bad time.
bPlace: There's no place like home | + | Lovingly Crafted in Wisconsin | V1.5